# Altium project USB_ASP_PROG.PrjPcb
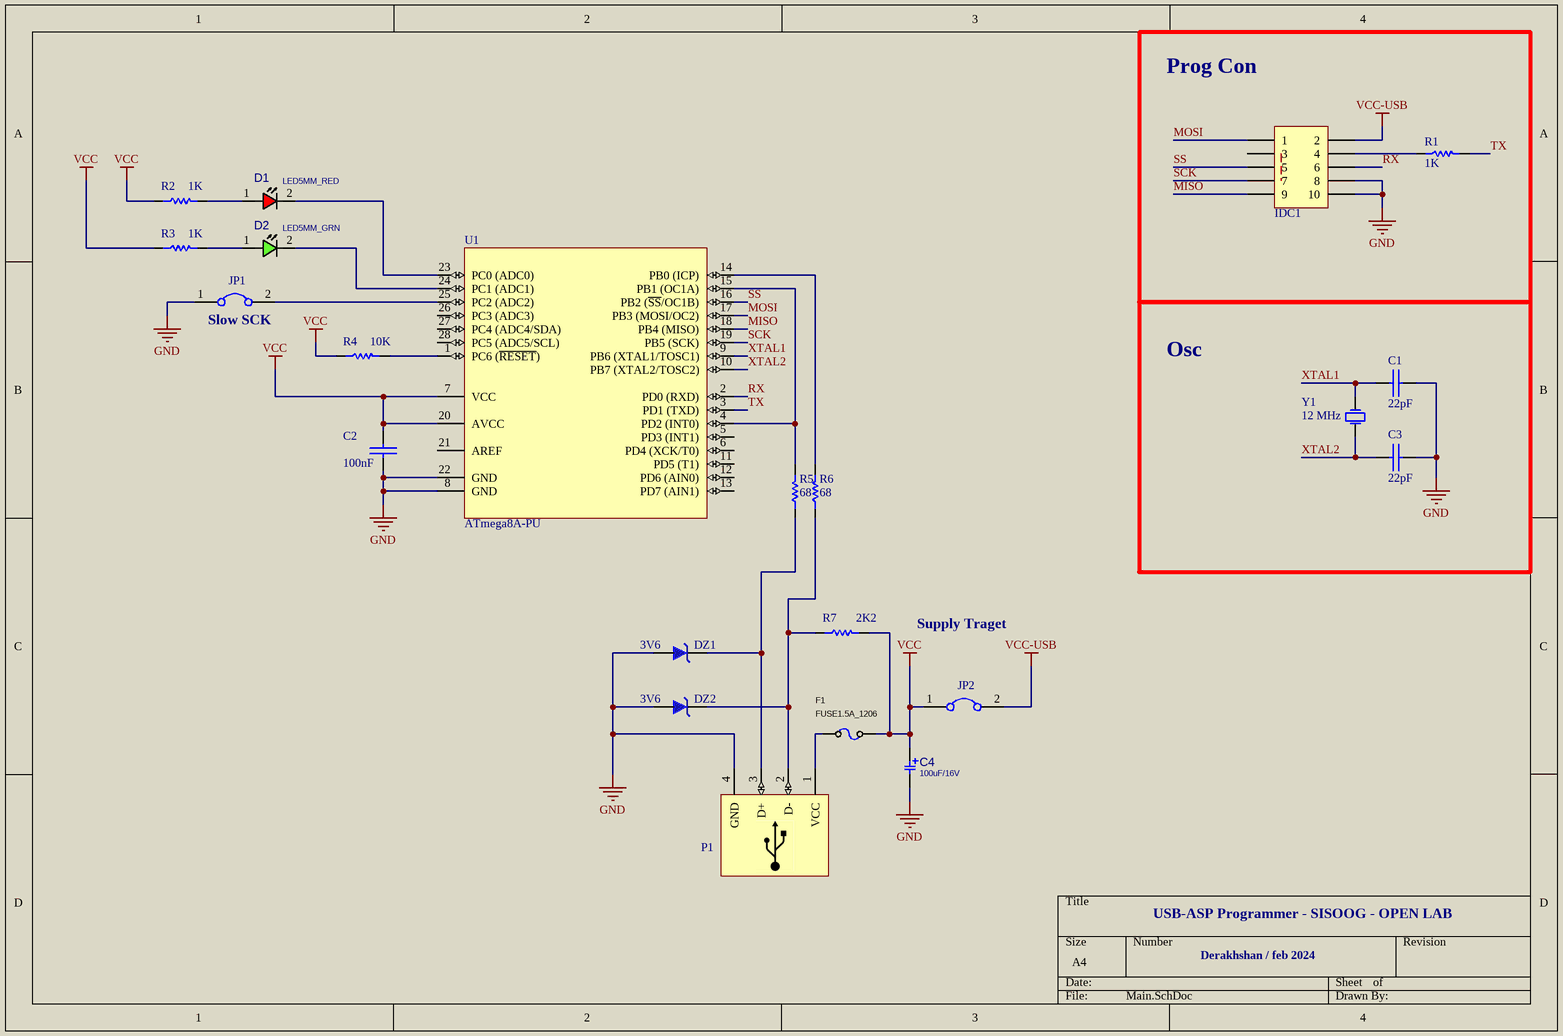
[diagram p0: Main.SchDoc]
1 sheet, 22 parts. Net scope: global (net labels, ports and power ports of the same name join across sheets).
Board file: PCB.PcbDoc

## Sheet Main.SchDoc
size A4; Date: 1111; DrawnBy: ali

### Parts
C1  22pF  [Cap - 100nF]
C2  100nF  [Cap - 100nF]
C3  22pF  [Cap - 100nF]
C4  100uF/16V  [C_EL_5X7]
D1  LED5MM_RED  [LED5MM_RED]
D2  LED5MM_GRN  [LED5MM_GRN]
DZ1  3V6  [DO 35]
DZ2  3V6  [DO 35]
F1  FUSE1.5A_1206  [F1206]
IDC1  CONNECTOR_IDC_5X2  [IDC2.54-10PIN]  (value not drawn)
JP1  Jumper  [Jumper Small - 2.54 - GRAY]  (value not drawn)
JP2  Jumper  [Jumper Small - 2.54 - GRAY]  (value not drawn)
P1  USB Connector  [USB2.5-2H4E]  (value not drawn)
R1  1K  [Res-(1/4)]
R2  1K  [Res-(1/4)]
R3  1K  [Res-(1/4)]
R4  10K  [Res-(1/4)]
R5  68  [Res-(1/4)]
R6  68  [Res-(1/4)]
R7  2K2  [Res-(1/4)]
U1  ATmega8A-PU  [28P3]
Y1  12 MHz  [XTAL 16MHZ]

### Blocks framed on the sheet
Prog Con: IDC1 R1
Osc: C1 C3 Y1

### Nets
GND: C1.2(-) C2.2(-) C3.2(-) C4.2 DZ1.1 DZ2.1 IDC1.8 IDC1.10 JP1.1 P1.4(GND) U1.8(GND) U1.22(GND)
VCC: C2.1(+) C4.1 F1.2 JP2.1 R2.1 R3.1 R4.1 R7.2 U1.7(VCC) U1.20(AVCC)
VCC-USB: IDC1.2 JP2.2
MISO: IDC1.9 U1.18(PB4_(MISO))
MOSI: IDC1.1 U1.17(PB3_(MOSI/OC2))
RX: IDC1.6 U1.2(PD0_(RXD))
SCK: IDC1.7 U1.19(PB5_(SCK))
SS: IDC1.5 U1.16(PB2_(~{SS}/OC1B))
TX: R1.2 U1.3(PD1_(TXD))
XTAL1: C1.1(+) U1.9(PB6_(XTAL1/TOSC1)) Y1.1(OSC1)
XTAL2: C3.1(+) U1.10(PB7_(XTAL2/TOSC2)) Y1.2(OSC2)
NetD1_1: D1.1(ANODE) R2.2
NetD1_2: D1.2(CATHODE) U1.23(PC0_(ADC0))
NetD2_1: D2.1(ANODE) R3.2
NetD2_2: D2.2(CATHODE) U1.24(PC1_(ADC1))
NetDZ1_2: DZ1.2 P1.3(D+) R5.1
NetDZ2_2: DZ2.2 P1.2(D-) R6.1 R7.1
NetF1_1: F1.1 P1.1(VCC)
NetIDC1_4: IDC1.4 R1.1
NetJP1_2: JP1.2 U1.25(PC2_(ADC2))
NetR4_2: R4.2 U1.1(PC6_(~{RESET}))
NetR5_2: R5.2 U1.4(PD2_(INT0)) U1.15(PB1_(OC1A))
NetR6_2: R6.2 U1.14(PB0_(ICP))

Not connected (* = marked no-connect by the designer): IDC1 3; U1 5(PD3_(INT1)) 6(PD4_(XCK/T0)) 11(PD5_(T1)) 12(PD6_(AIN0)) 13(PD7_(AIN1)) 21(AREF) 26(PC3_(ADC3)) 27(PC4_(ADC4/SDA)) 28(PC5_(ADC5/SCL))

### Notes on the sheet
- (near JP1) Slow SCK
- Supply Traget
- USB-ASP Programmer - SISOOG - OPEN LAB
- Derakhshan / feb 2024

### Library data of the parts
C1-C3 = Cap-Bipolar: Bipolar Capacitor; Voltage: 100V; Designer: Saeid Jorablo; Organazation: ControTec; Adding Date: 1387/12/20
  C1 C3: Value: 22pF
  C2: Value: 100nF
C4 = CAP_THD_EL: CAP, THD, ELEC,; MANF_P#: MANF_PART#; PARAM2: 25V; DESC: DESCRIPTION; DIST#: MOUSER; PARAM: 20%; PRICE: 10= 5$; MANF: MANF; ASSEMBLY: ASSEMBLY; VALUE: 100uF/16V
D1 = LED_THD_5MM_RED: LED, THD, 5MM, RED; DESC: DESCRIPTION; MANF_P#: MANF_PART#; PARAM2: 2.2V; MANF: MANF; ASSEMBLY: ASSEMBLY; PRICE: PRICE; VALUE: LED5MM_RED
D2 = LED_THD_5MM_GRN: LED, THD, 5MM, GREEN; DESC: DESCRIPTION; MANF_P#: MANF_PART#; PARAM2: 2.2V; MANF: MANF; ASSEMBLY: ASSEMBLY; PRICE: PRICE; VALUE: LED5MM_GRN
DZ1 DZ2 = ZENER GENERAL DIODE: DIODE ZENER GENERAL; Published: 2017-1-12; PackageVersion: 2017-1-12; PackageReference: DO 35; Publisher: Abbas Basereh; PackageDescription: DIODE GEN ZENER; ComponentLink1Description: Manufacturer Link; ComponentLink2Description: Datasheet; VALUE: 3V6
F1 = FUSE_3A_1206_SLOW: Fuse, 3A, 32VDC, 1206, SMD, Slow Blow; PARAM: 3A; 32VDC; Slow Blow; MANF: Bourns; MANF_P#: SF-1206SP300-2; PARAM2: 0.027Ohm; PRICE: 0.9$; VALUE: FUSE1.5A_1206
IDC1 = IDC 5X2: IDC, 5-Pin, Dual row; Manufacturer: CHINA; designer: ABBAS BASEREH; Connector type: IDC5X2  PROGPIN; Max Current: mA; LatestRevisionDate: 1395-11-17; Publisher: ABBAS BASEREH; Mounting Technology: Through-Hole; Category: Connector; Pin Count: 10; Status: Unreleased; ComponentLink1Description: Datasheet; ComponentLink2Description: Reference; Update: 2017-2-4
JP1 JP2 = Jumper: Company: E.P.I.L; Defualt State: Close; Design Date: 2011/11/02
P1 = USB B-Type: USB Connector-B Type; Adding Date: 10/26/2010
R1-R7 = Resistor
  R1-R3: Value: 1K
  R4: Value: 10K
  R5 R6: Value: 68
  R7: Value: 2K2
U1 = ATmega8A-PU: 8-bit AVR Microcontroller, 8KB Flash, 512 Bytes EEPROM, 1KB SRAM, 28-pin PDIP, Industrial Grade (-40°C to 85°C); Published: 2017-1-5; DatasheetVersion: 2017-1-5; PackageVersion: 2017-1-5; PackageReference: 28P3; Publisher: Abbas Basereh; PackageDescription: 28-lead (0.300"/7.62mm Wide) Plastic Dual Inline Package (PDIP); Supplier 1: Digi-Key; Supplier Part Number 1: ATMEGA8A-PU-ND; Supplier 2: Farnell; Supplier Part Number 2: 1748534; Supplier 3: Mouser; Supplier Part Number 3: 556-ATMEGA8A-PU; ComponentLink1Description: Manufacturer Link; ComponentLink1URL: http://www.atmel.com/products/avr/default.asp?; ComponentLink2Description: ATmega8A Datasheet; ComponentLink2URL: http://www.atmel.com/dyn/resources/prod_documents/doc8159.pdf; ComponentLink3Description: ATmega8A Summary; ComponentLink3URL: http://www.atmel.com/dyn/resources/prod_documents/8159S.pdf; ComponentLink4Description: Atmel.com Home; ComponentLink4URL: http://www.atmel.com
Y1 = XTAL: XTAL Crystal; Designer: ABBAS BASEREH; Design Date: 2017-1-3; ComponentLink1Description: Datasheet; ComponentLink2Description: Reference; Mounting Technology: Surface Mount\Through-Hole; Value: 12 MHz; Status: Unreleased